# Altium project G431_Platform.PrjPcb
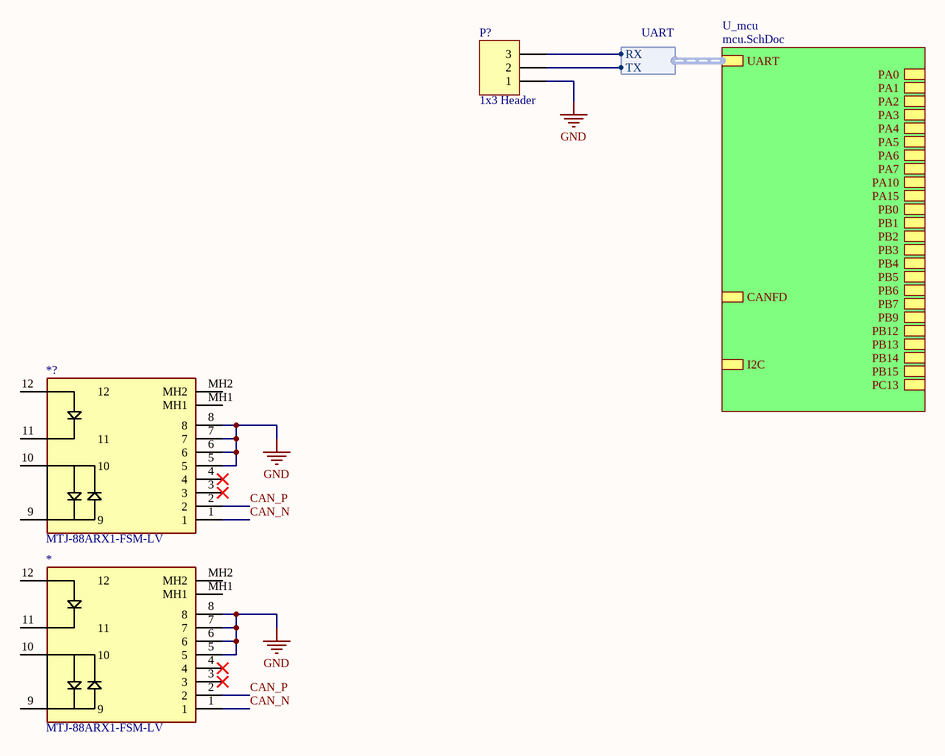
[diagram p0: main.SchDoc]
2 sheets, 19 parts. Net scope: hierarchical (ports join the sheet entries above them; power ports are global).
Sheets:
  main.SchDoc
    U_mcu = mcu.SchDoc

## Sheet main.SchDoc
size A4; SheetNumber: 1; SheetTotal: 2

### Parts
*  MTJ-88ARX1-FSM-LV  [MTJ-88ARX1-FSM-LV]
*?  MTJ-88ARX1-FSM-LV  [MTJ-88ARX1-FSM-LV]
P?  1x3 Header  [HDR1X3]

### Sub-sheets
U_mcu = mcu.SchDoc: CANFD (harness CANFD), UART (harness UART), I2C (harness I2C), PA0, PA1, PA2, PA3, PA4, PA5, PA6, PA7, PA10, PA15, PB0, PB1, PB2, PB3, PB4, PB5, PB6, PB7, PB9, PB12, PB13, PB14, PB15, PC13

### Harnesses
UART: RX, TX

### Nets
GND: *.5 *.6 *.7 *.8 *?.5 *?.6 *?.7 *?.8 P?.1
CAN_N: *.1 *?.1
CAN_P: *.2 *?.2
UART3_RX: P?.3 ; sheet U_mcu/UART.RX
UART3_TX: P?.2 ; sheet U_mcu/UART.TX

Not connected (* = marked no-connect by the designer): * 3* 4* 9 10 11 12 MH1 MH2; *? 3* 4* 9 10 11 12 MH1 MH2

### Library data of the parts
* *? = MTJ-88ARX1-FSM-LV: RJ45 Connector
P? = 1x3 Header: 1x3 Pin Header

## Sheet mcu.SchDoc
size A4; SheetNumber: 2; SheetTotal: 2
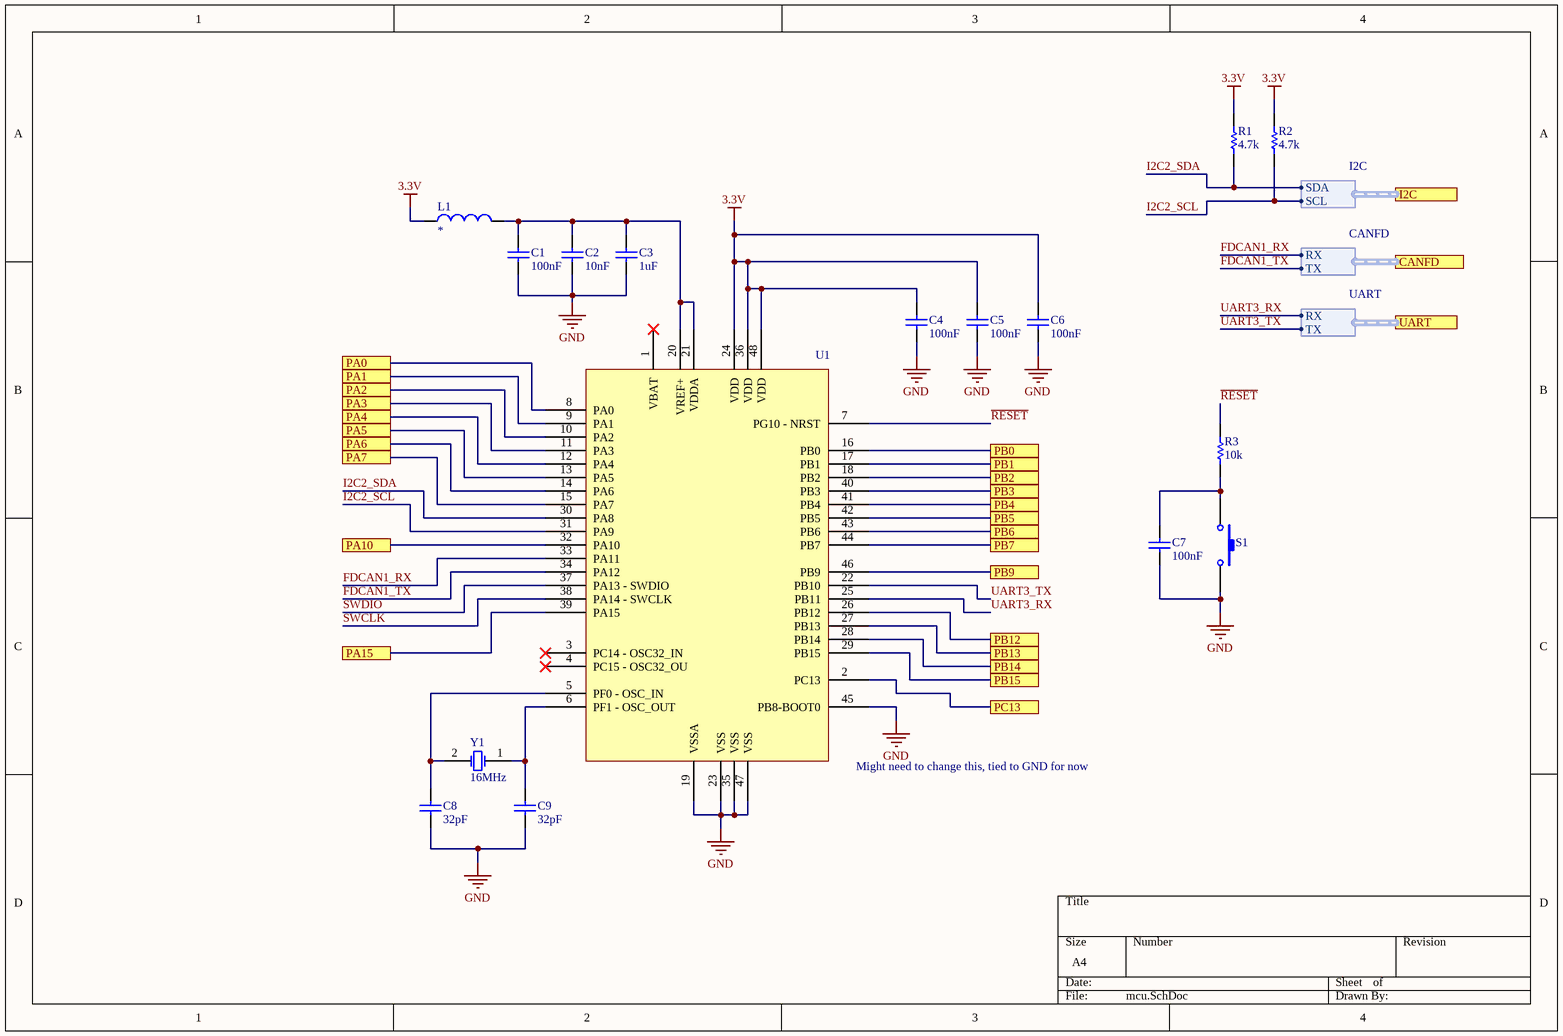
[diagram p1: mcu.SchDoc]

### Parts
C1  value 100nF  [0603 - Capacitor]  (hidden comment: Capacitor - Nonpolarized)
C2  value 10nF  [0603 - Capacitor]  (hidden comment: Capacitor - Nonpolarized)
C3  value 1uF  [0603 - Capacitor]  (hidden comment: Capacitor - Nonpolarized)
C4  value 100nF  [0603 - Capacitor]  (hidden comment: Capacitor - Nonpolarized)
C5  value 100nF  [0603 - Capacitor]  (hidden comment: Capacitor - Nonpolarized)
C6  value 100nF  [0603 - Capacitor]  (hidden comment: Capacitor - Nonpolarized)
C7  value 100nF  [0603 - Capacitor]  (hidden comment: Capacitor - Nonpolarized)
C8  value 32pF  [0603 - Capacitor]  (hidden comment: Capacitor - Nonpolarized)
C9  value 32pF  [0603 - Capacitor]  (hidden comment: Capacitor - Nonpolarized)
L1  Inductor  [MSS1210 - INDUCTOR]  (value not drawn)
R1  value 4.7k  [0603 - Resistor]  (hidden comment: Resistor)
R2  value 4.7k  [0603 - Resistor]  (hidden comment: Resistor)
R3  value 10k  [0603 - Resistor]  (hidden comment: Resistor)
S1  Switch - Push Button  [6x6mm Switch]  (value not drawn)
U1  STM32G431C6T6  [TSQFP50P900X900X160-48N]  (value not drawn)
Y1  value 16MHz  [2-SMD NO LEAD CRSYSTAL]  (hidden comment: Oscillator)

### Ports
CANFD (harness CANFD), I2C (harness I2C), PA0, PA1, PA2, PA3, PA4, PA5, PA6, PA7, PA10, PA15, PB0, PB1, PB2, PB3, PB4, PB5, PB6, PB7, PB9, PB12, PB13, PB14, PB15, PC13, UART (harness UART)

### Harnesses
CANFD: RX, TX
UART: RX, TX
I2C: SDA, SCL

### Nets
3.3V: C4.2 C5.2 C6.2 L1.1 R1.2 R2.2 U1.24(VDD) U1.36(VDD) U1.48(VDD)
GND: C1.1 C2.1 C3.1 C4.1 C5.1 C6.1 C7.1 C8.1 C9.1 S1.2 U1.19(VSSA) U1.23(VSS) U1.35(VSS) U1.45(PB8-BOOT0) U1.47(VSS)
FDCAN1_RX: U1.33(PA11) ; port CANFD.RX
FDCAN1_TX: U1.34(PA12) ; port CANFD.TX
I2C2_SCL: R2.1 U1.31(PA9) ; port I2C.SCL
I2C2_SDA: R1.1 U1.30(PA8) ; port I2C.SDA
~{RESET}: R3.2 U1.7(PG10_-_NRST)
SWCLK: U1.38(PA14_-_SWCLK)
SWDIO: U1.37(PA13_-_SWDIO)
UART3_RX: U1.25(PB11) ; port UART.RX
UART3_TX: U1.22(PB10) ; port UART.TX
NetC1_2: C1.2 C2.2 C3.2 L1.2 U1.20(VREF+) U1.21(VDDA)
NetC7_2: C7.2 R3.1 S1.1
NetC8_2: C8.2 U1.5(PF0_-_OSC_IN) Y1.2(OSC2)
NetC9_2: C9.2 U1.6(PF1_-_OSC_OUT) Y1.1(OSC1)
NetU1_2: U1.2(PC13) ; port PC13
NetU1_8: U1.8(PA0) ; port PA0
NetU1_9: U1.9(PA1) ; port PA1
NetU1_10: U1.10(PA2) ; port PA2
NetU1_11: U1.11(PA3) ; port PA3
NetU1_12: U1.12(PA4) ; port PA4
NetU1_13: U1.13(PA5) ; port PA5
NetU1_14: U1.14(PA6) ; port PA6
NetU1_15: U1.15(PA7) ; port PA7
NetU1_16: U1.16(PB0) ; port PB0
NetU1_17: U1.17(PB1) ; port PB1
NetU1_18: U1.18(PB2) ; port PB2
NetU1_26: U1.26(PB12) ; port PB12
NetU1_27: U1.27(PB13) ; port PB13
NetU1_28: U1.28(PB14) ; port PB14
NetU1_29: U1.29(PB15) ; port PB15
NetU1_32: U1.32(PA10) ; port PA10
NetU1_39: U1.39(PA15) ; port PA15
NetU1_40: U1.40(PB3) ; port PB3
NetU1_41: U1.41(PB4) ; port PB4
NetU1_42: U1.42(PB5) ; port PB5
NetU1_43: U1.43(PB6) ; port PB6
NetU1_44: U1.44(PB7) ; port PB7
NetU1_46: U1.46(PB9) ; port PB9

Not connected (* = marked no-connect by the designer): U1 1(VBAT)* 3(PC14_-_OSC32_IN)* 4(PC15_-_OSC32_OU)*

### Notes on the sheet
- (near U1) Might need to change this, tied to GND for now

### Library data of the parts
C1-C9 = Capacitor - Nonpolarized: Nonpolarized Capacitor; Supplier Part Number: *; Supplier: *; Manufacturer: *; Rating: *; Manufacturer Part Number: *
S1 = Switch - Push Button: Push Button Switch; Supplier: *; Manufacturer Part Number: *; Manufacturer: *; Supplier Part Number: *; Rating: *; Value: *
U1 = STM32G431C6T6: MCU 32BIT 32KB FLASH 48LQFP; Manufacturer: ST; Manufacturer Part Number: STM32G431C6T6; Supplier: Digikey; Supplier Part Number: STM32G431C6T6-ND
Y1 = Oscillator: Crystal Oscillator; Manufacturer Part Number: *; Manufacturer: *; Supplier Part Number: *; Supplier: *; Rating: *
L1 = Inductor: Rating: *; Manufacturer Part Number: *; Supplier Part Number: *; Supplier: *; Manufacturer: *; Value: *
R1-R3 = Resistor: Rating: *; Manufacturer Part Number: *; Manufacturer: *; Supplier Part Number: *; Supplier: *

## Nets that join several sheets
GND: main (9 pins), mcu (15 pins)
UART3_RX: main (P?.3), mcu (U1.25)
UART3_TX: main (P?.2), mcu (U1.22)